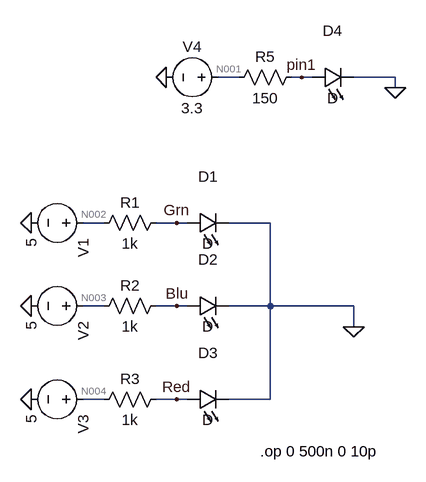
[diagram p0: schematic RGB_LED.asc]
RGB_LED.asc, the LTspice schematic file:
Version 4
SHEET 1 880 680
WIRE 240 -160 208 -160
WIRE 336 -160 320 -160
WIRE 352 -160 336 -160
WIRE 480 -160 416 -160
WIRE 480 -144 480 -160
WIRE 32 64 0 64
WIRE 144 64 112 64
WIRE 160 64 144 64
WIRE 288 64 224 64
WIRE 32 192 0 192
WIRE 144 192 112 192
WIRE 160 192 144 192
WIRE 288 192 288 64
WIRE 288 192 224 192
WIRE 416 192 288 192
WIRE 416 224 416 192
WIRE 32 336 0 336
WIRE 144 336 112 336
WIRE 160 336 144 336
WIRE 288 336 288 192
WIRE 288 336 224 336
FLAG -80 64 0
FLAG 416 224 0
FLAG 144 64 Grn
FLAG 144 192 Blu
FLAG 144 336 Red
FLAG -80 192 0
FLAG -80 336 0
FLAG 480 -144 0
FLAG 128 -160 0
FLAG 336 -160 pin1
SYMBOL LED 160 80 R270
WINDOW 0 72 32 VTop 2
WINDOW 3 0 32 VBottom 2
SYMATTR InstName D1
SYMBOL LED 160 208 R270
WINDOW 0 72 32 VTop 2
WINDOW 3 0 32 VBottom 2
SYMATTR InstName D2
SYMBOL LED 160 352 R270
WINDOW 0 72 32 VTop 2
WINDOW 3 0 32 VBottom 2
SYMATTR InstName D3
SYMBOL res 128 48 R90
WINDOW 0 0 56 VBottom 2
WINDOW 3 32 56 VTop 2
SYMATTR InstName R1
SYMATTR Value 1k
SYMBOL res 128 176 R90
WINDOW 0 0 56 VBottom 2
WINDOW 3 32 56 VTop 2
SYMATTR InstName R2
SYMATTR Value 1k
SYMBOL res 128 320 R90
WINDOW 0 0 56 VBottom 2
WINDOW 3 32 56 VTop 2
SYMATTR InstName R3
SYMATTR Value 1k
SYMBOL voltage 16 64 R90
WINDOW 123 0 0 Left 0
WINDOW 39 0 0 Left 0
SYMATTR InstName V1
SYMATTR Value 5
SYMBOL voltage 16 192 R90
WINDOW 123 0 0 Left 0
WINDOW 39 0 0 Left 0
SYMATTR InstName V2
SYMATTR Value 5
SYMBOL voltage 16 336 R90
WINDOW 123 0 0 Left 0
WINDOW 39 0 0 Left 0
SYMATTR InstName V3
SYMATTR Value 5
SYMBOL LED 352 -144 R270
WINDOW 0 72 32 VTop 2
WINDOW 3 0 32 VBottom 2
SYMATTR InstName D4
SYMBOL res 336 -176 R90
WINDOW 0 0 56 VBottom 2
WINDOW 3 32 56 VTop 2
SYMATTR InstName R5
SYMATTR Value 150
SYMBOL voltage 224 -160 R90
WINDOW 0 -32 56 VBottom 2
WINDOW 3 32 56 VTop 2
WINDOW 123 0 0 Left 0
WINDOW 39 0 0 Left 0
SYMATTR InstName V4
SYMATTR Value 3.3
TEXT 272 416 Left 2 !.op 0 500n 0 10p

The netlist it stands for:
* RGB_LED.asc
D1 Grn 0 D
D2 Blu 0 D
D3 Red 0 D
R1 Grn N002 1k
R2 Blu N003 1k
R3 Red N004 1k
V1 N002 0 5
V2 N003 0 5
V3 N004 0 5
D4 pin1 0 D
R5 pin1 N001 150
V4 N001 0 3.3
.model D D
.lib standard.dio
.op 0 500n 0 10p
.backanno
.end

* Results of the author's LTspice run, read from the files saved beside the schematic
* Operating Point:
*   V(grn) = 692.9 mV
*   V(blu) = 692.9 mV
*   V(red) = 692.9 mV
*   V(n002) = 5 V
*   V(n003) = 5 V
*   V(n004) = 5 V
*   V(pin1) = 728.6 mV
*   V(n001) = 3.3 V
*   I(D4) = 17.14 mA
*   I(D3) = 4.307 mA
*   I(D2) = 4.307 mA
*   I(D1) = 4.307 mA
*   I(R5) = -17.14 mA
*   I(R3) = -4.307 mA
*   I(R2) = -4.307 mA
*   I(R1) = -4.307 mA
*   I(V4) = -17.14 mA
*   I(V3) = -4.307 mA
*   I(V2) = -4.307 mA
*   I(V1) = -4.307 mA
* From the log:
*   Semiconductor Device Operating Points:
*                           --- Diodes ---
*   Name:      d4          d3          d2          d1
*   Model:      d           d           d           d
*   Id:      1.71e-02    4.31e-03    4.31e-03    4.31e-03
*   Vd:      7.29e-01    6.93e-01    6.93e-01    6.93e-01
*   Req:     1.51e+00    6.01e+00    6.01e+00    6.01e+00
*   CAP:     0.00e+00    0.00e+00    0.00e+00    0.00e+00